# EAGLE schematic pandemic-v0001 (EAGLE 9.3.2)

## Sheet 1 of 2: PSU
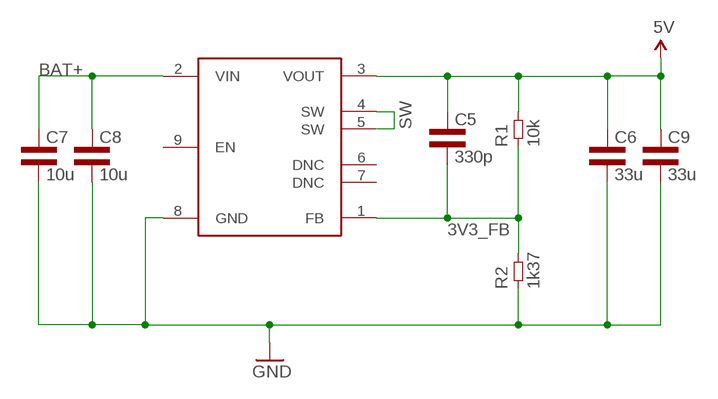
[diagram p0: schematic, sheet 1]

### Parts
C5  330p  CAP0402L3  [0402L3]
C6  33u  CAP1210L3  [1210L3]
C7  10u  CAP1210L3  [1210L3]
C8  10u  CAP1210L3  [1210L3]
C9  33u  CAP1210L3  [1210L3]
R1  10k  RES0402L3  [0402L3]
R2  1k37  RES0402L3  [0402L3]
U2  TPSM84209RKH  [TPSM84209RKHT]

### Nets
3V3_FB: C5.P$2 R1.P$1 R2.P$2 U2.1(FB)
5V: C5.P$1 C6.P$1 C9.P$1 R1.P$2 U2.3(VOUT)
BAT+: C7.P$1 C8.P$1 U2.2(VIN)
GND: C6.P$2 C7.P$2 C8.P$2 C9.P$2 R2.P$1 U2.8(GND) ; also sheet 2
SW: U2.4(SW) U2.5(SW)
Unconnected: U2.6(DNC) U2.7(DNC) U2.9(EN)

## Sheet 2 of 2: MCU
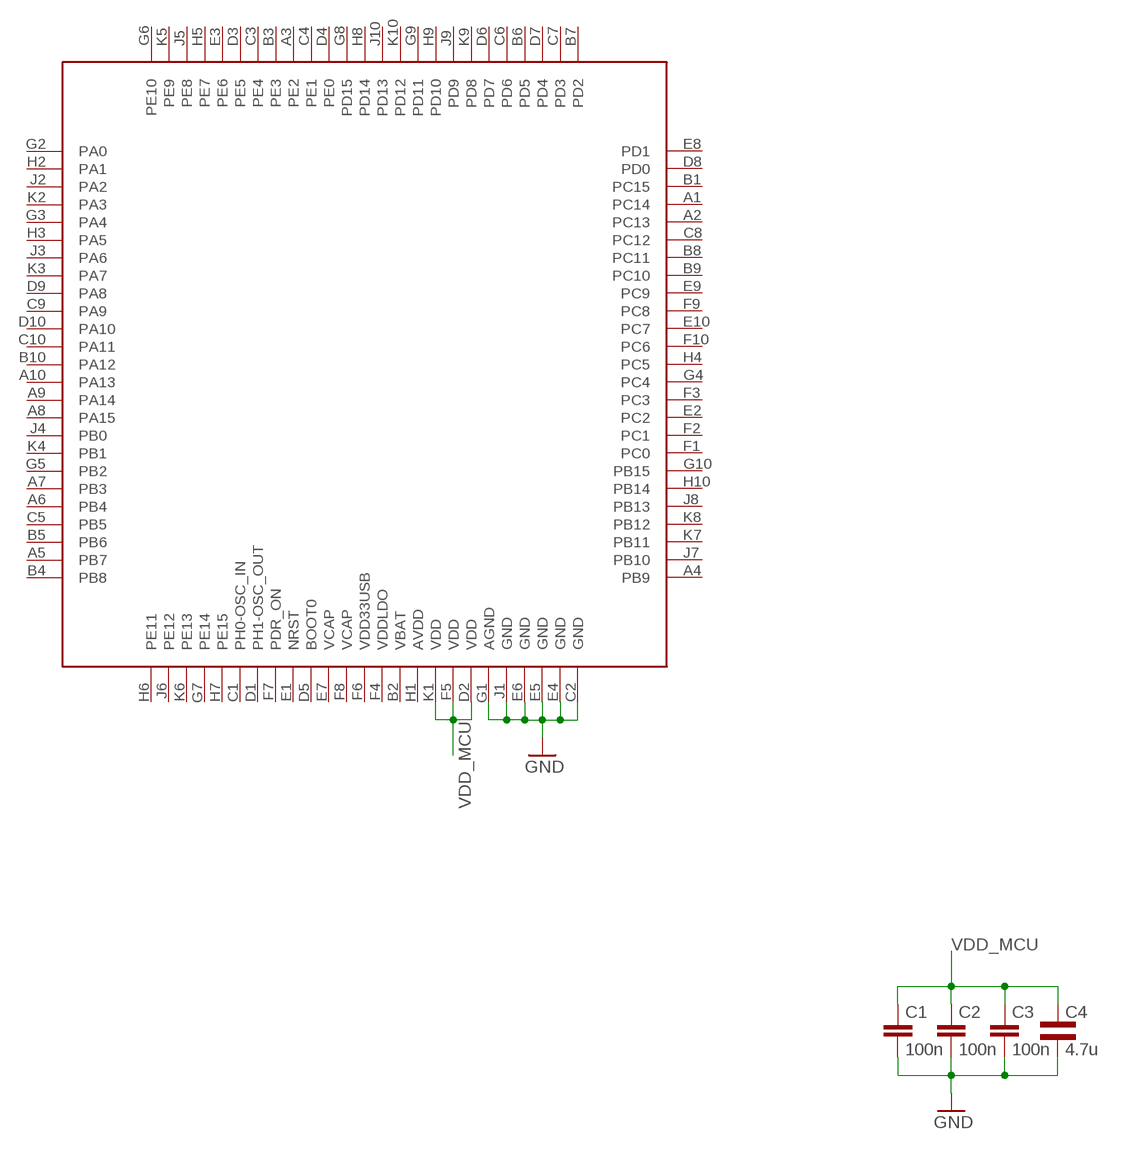
[diagram p1: schematic, sheet 2]

### Parts
C1  100n  C-EUC0201  [C0201]
C2  100n  C-EUC0201  [C0201]
C3  100n  C-EUC0201  [C0201]
C4  4.7u  CAP0805L3  [0805L3]
U1  STM32H743VIH  [BGA100C80P10X10_800X800X110]

### Nets
GND: C1.2 C2.2 C3.2 C4.2 U1.C2(GND) U1.E4(GND) U1.E5(GND) U1.E6(GND) U1.G1(AGND) U1.J1(GND) ; also sheet 1
VDD_MCU: C1.1 C2.1 C3.1 C4.1 U1.D2(VDD) U1.F5(VDD) U1.K1(VDD)
Unconnected: U1.A1(PC14) U1.A2(PC13) U1.A3(PE2) U1.A4(PB9) U1.A5(PB7) U1.A6(PB4) U1.A7(PB3) U1.A8(PA15) U1.A9(PA14) U1.A10(PA13) U1.B1(PC15) U1.B2(VBAT) U1.B3(PE3) U1.B4(PB8) U1.B5(PB6) U1.B6(PD5) U1.B7(PD2) U1.B8(PC11) U1.B9(PC10) U1.B10(PA12) U1.C1(PH0-OSC_IN) U1.C3(PE4) U1.C4(PE1) U1.C5(PB5) U1.C6(PD6) U1.C7(PD3) U1.C8(PC12) U1.C9(PA9) U1.C10(PA11) U1.D1(PH1-OSC_OUT) U1.D3(PE5) U1.D4(PE0) U1.D5(BOOT0) U1.D6(PD7) U1.D7(PD4) U1.D8(PD0) U1.D9(PA8) U1.D10(PA10) U1.E1(NRST) U1.E2(PC2) U1.E3(PE6) U1.E7(VCAP) U1.E8(PD1) U1.E9(PC9) U1.E10(PC7) U1.F1(PC0) U1.F2(PC1) U1.F3(PC3) U1.F4(VDDLDO) U1.F6(VDD33USB) U1.F7(PDR_ON) U1.F8(VCAP) U1.F9(PC8) U1.F10(PC6) U1.G2(PA0) U1.G3(PA4) U1.G4(PC4) U1.G5(PB2) U1.G6(PE10) U1.G7(PE14) U1.G8(PD15) U1.G9(PD11) U1.G10(PB15) U1.H1(AVDD) U1.H2(PA1) U1.H3(PA5) U1.H4(PC5) U1.H5(PE7) U1.H6(PE11) U1.H7(PE15) U1.H8(PD14) U1.H9(PD10) U1.H10(PB14) U1.J2(PA2) U1.J3(PA6) U1.J4(PB0) U1.J5(PE8) U1.J6(PE12) U1.J7(PB10) U1.J8(PB13) U1.J9(PD9) U1.J10(PD13) U1.K2(PA3) U1.K3(PA7) U1.K4(PB1) U1.K5(PE9) U1.K6(PE13) U1.K7(PB11) U1.K8(PB12) U1.K9(PD8) U1.K10(PD12)

## Library data of the parts
C1-C3 = rcl:C-EU: CAPACITOR, European symbol; SPICEPREFIX: C
C4-C9 = common:CAP
R1 R2 = common:RES
U1 = common:STM32H743VI: STM32H743VI - High performance ARM Cortex-M7 32-bit Arm® Cortex®-M7 core with doubleprecision FPU and L1 cache: 16 Kbytes of data and 16 Kbytes of instruction cache; frequency up to 400 MHz, MPU, 856 DMIPS/ 2.14 DMIPS/MHz (Dhrystone 2.1), and DSP instructions Up to 2 Mbytes of Flash memory with readwhile-write support 1 Mbyte of RAM: 192 Kbytes of TCM RAM (inc. 64 Kbytes of ITCM RAM + 128 Kbytes of DTCM RAM for time critical routines), 864 Kbytes of user SRAM, and 4 Kbytes of SRAM in Backup domain Dual mode Quad-SPI memory interface running up to 133 MHz Flexible external memory controller with up to 32-bit data bus: SRAM, PSRAM, SDRAM/LPSDR SDRAM, NOR/NAND Flash memory clocked up to 133 MHz in Synchronous mode CRC calculation unit STM32H743VI Datasheet <https://www.mouser.com/datasheet/2/389/stm32h743bi-1156566.pdf> Programming Manual <https://www.st.com/resource/en/programming_manual/dm00237416.pdf> Hardware JPEG Decoder <https://www.st.com/resource/en/application_note/dm00356635.pdf> ST Product Homepage STM32H743VI Home <https://www.st.com/content/st_com/en/products/microcontrollers-microprocessors/stm32-32-bit-arm-cortex-mcus/stm32-high-performance-mcus/stm32h7-series/stm32h743-753/stm32h743vi.html#>
U2 = SamacSys_Parts:TPSM84209